# Altium schematic sheet 创意F1.SchDoc
size 762 x 401 mm
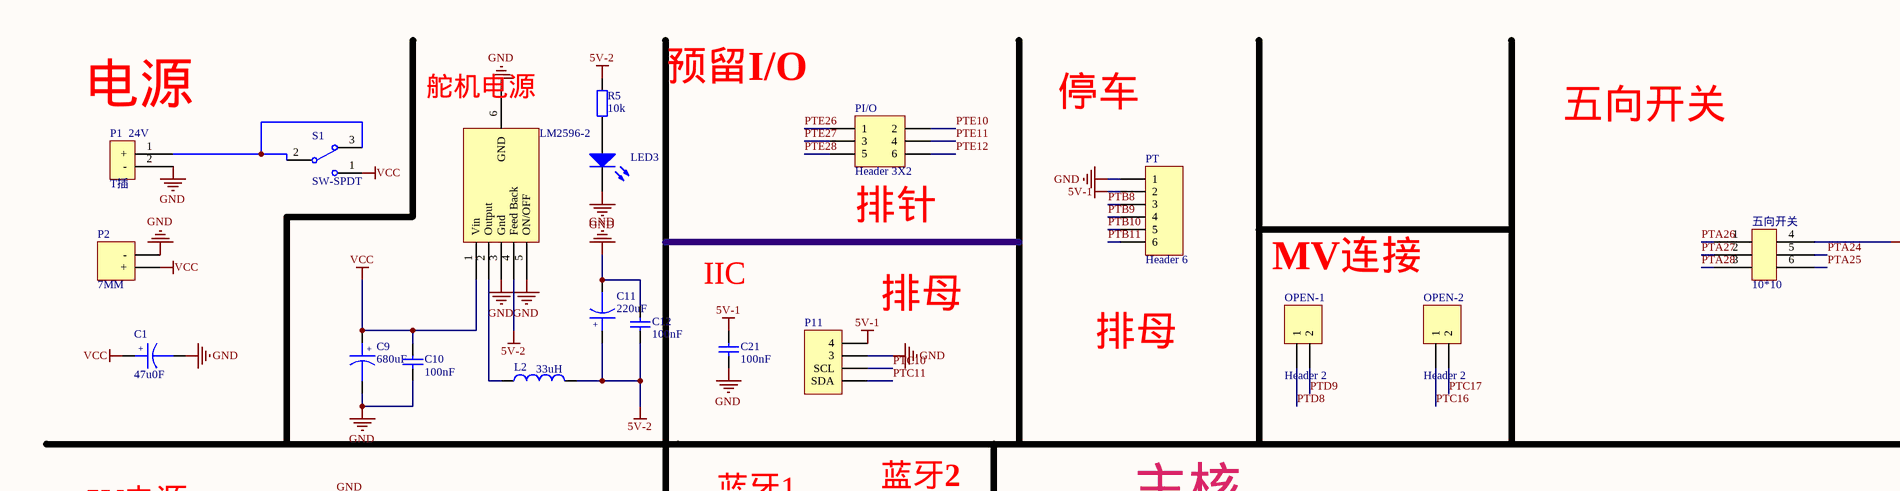
[diagram p0: 创意F1.SchDoc, top left]
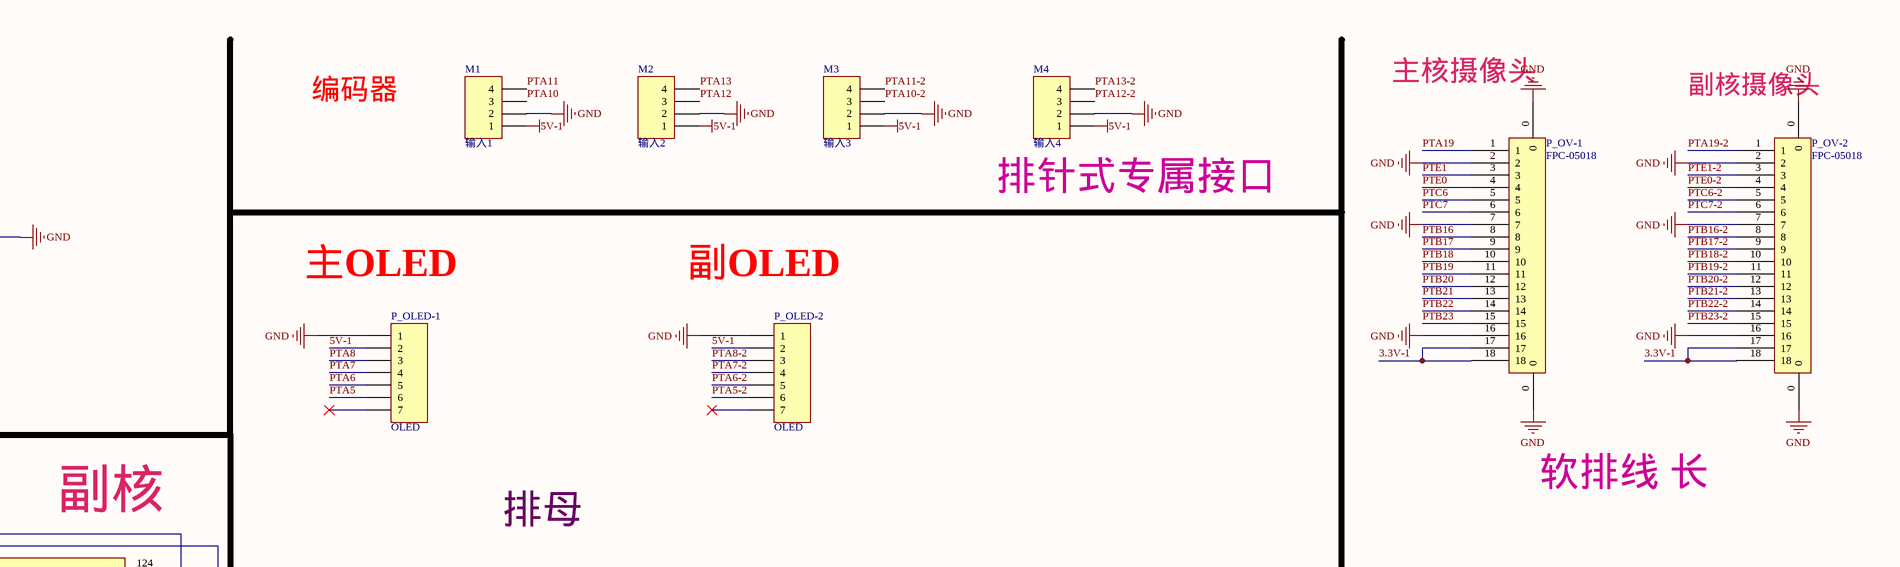
[diagram p1: 创意F1.SchDoc, top right]
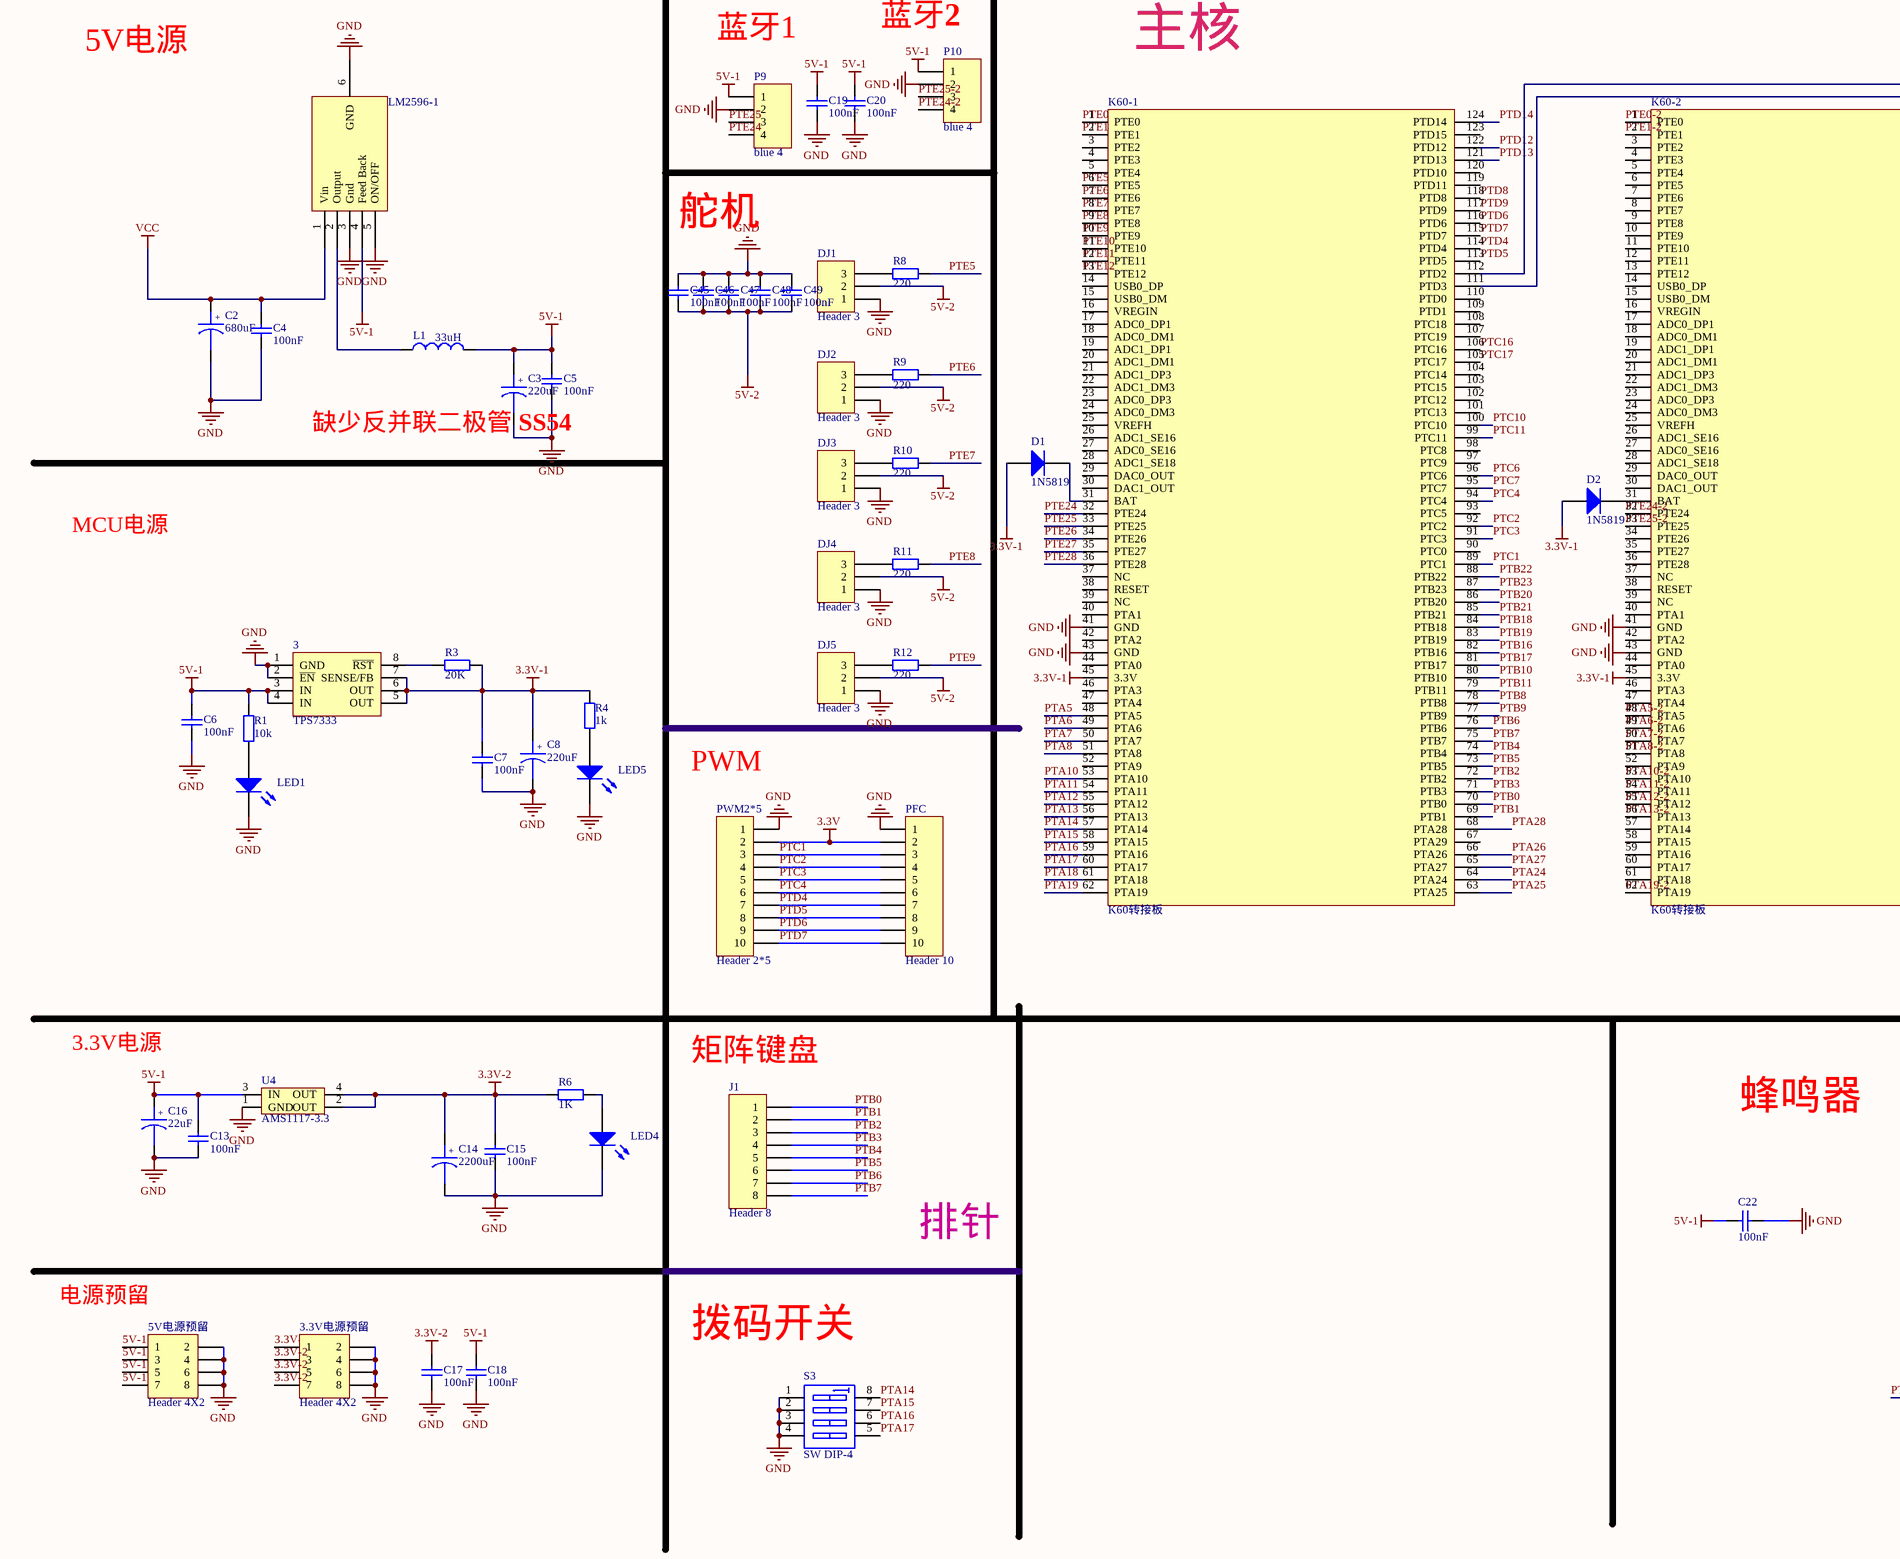
[diagram p2: 创意F1.SchDoc, bottom left]
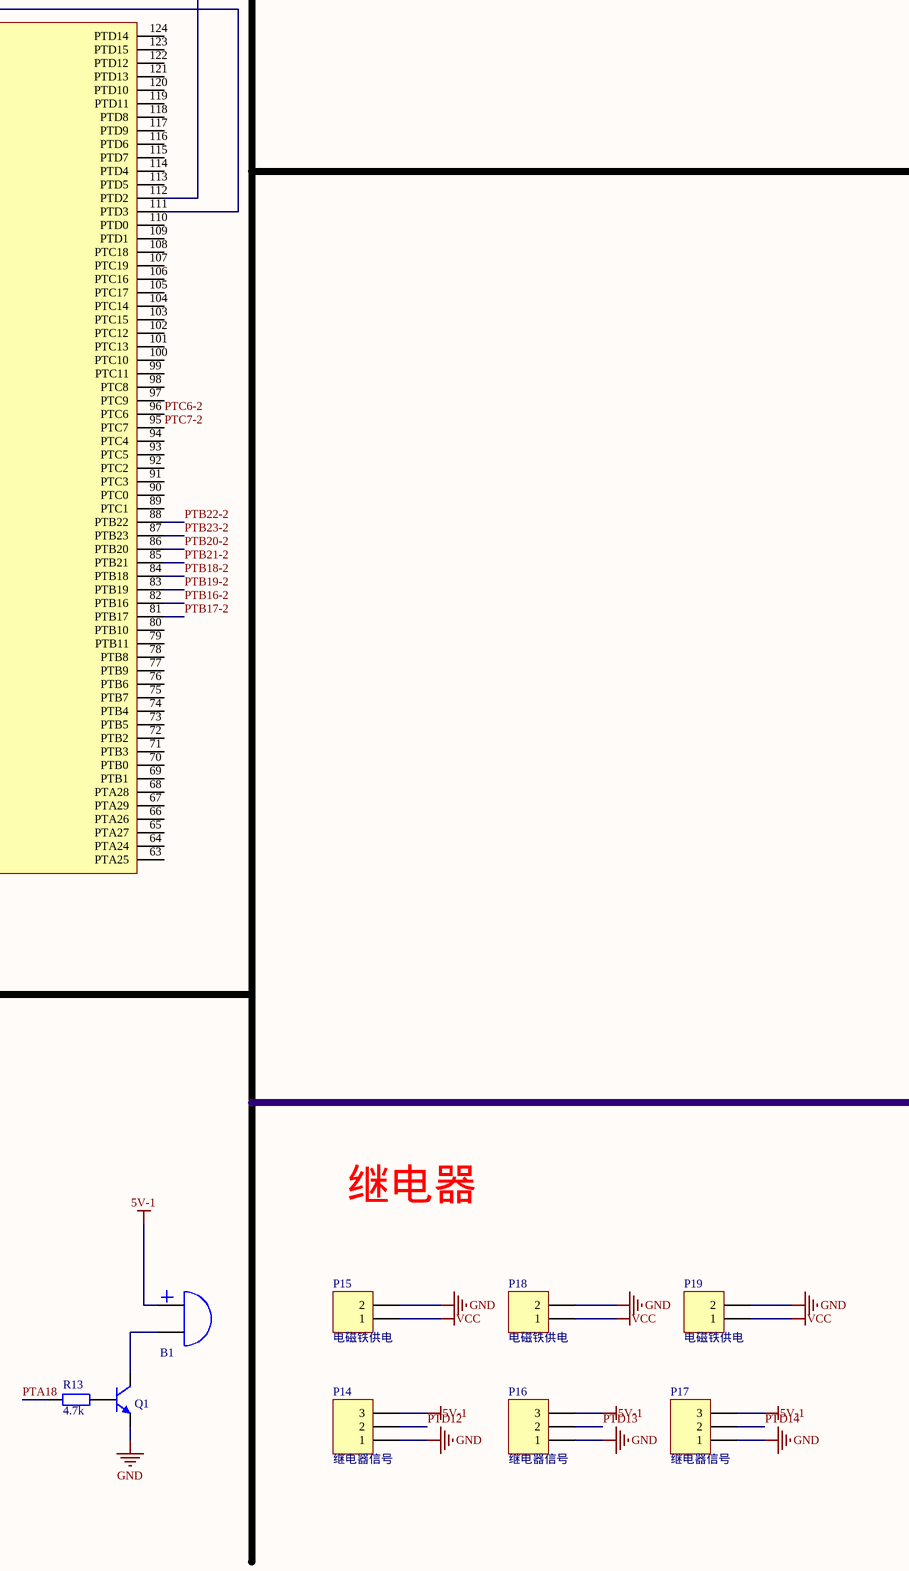
[diagram p3: 创意F1.SchDoc, bottom right]

## Parts
3  TPS7333  [SOP8]
3.3V电源预留  Header 4X2  [header2*4]
5V电源预留  Header 4X2  [header2*4]
B1  Bell  [蜂鸣器]  (value not drawn)
C1  47u0F  [RB-2]
C2  680uF  [RB-2]
C3  220uF  [贴片电容]
C4  100nF  [0805]
C5  100nF  [0805]
C6  100nF  [0805]
C7  100nF  [0805]
C8  220uF  [SMC]
C9  680uF  [RB-2]
C10  100nF  [0805]
C11  220uF  [贴片电容]
C12  100nF  [0805]
C13  100nF  [0805]
C14  2200uF  [贴片电容]
C15  100nF  [0805]
C16  22uF  [贴片电容]
C17  100nF  [0805]
C18  100nF  [0805]
C19  100nF  [0805]
C20  100nF  [0805]
C21  100nF  [0805]
C22  100nF  [0805]
C45  100nF  [0805]
C46  100nF  [0805]
C47  100nF  [0805]
C48  100nF  [0805]
C49  100nF  [0805]
D1  1N5819  [SMB]
D2  1N5819  [SMB]
DJ1  Header 3  [HDR1X3_]
DJ2  Header 3  [HDR1X3_]
DJ3  Header 3  [HDR1X3_]
DJ4  Header 3  [HDR1X3_]
DJ5  Header 3  [HDR1X3_]
J1  Header 8  [HDR1X8_]
K60-1  K60转接板  [K60核心板]
K60-2  K60转接板  [K60核心板]
L1  33uH  [RB-4]
L2  33uH  [RB-4]
LED1  (no value)  [0805]
LED3  (no value)  [0805]
LED4  (no value)  [0805]
LED5  (no value)  [0805]
LM2596-1  Component_1  [TO-263-5]  (value not drawn)
LM2596-2  Component_1  [TO-263-5]  (value not drawn)
M1  输入1  [HDR1X4_]
M2  输入2  [HDR1X4_]
M3  输入3  [HDR1X4_]
M4  输入4  [HDR1X4_]
OPEN-1  Header 2  [HDR1X2_]
OPEN-2  Header 2  [HDR1X2_]
P1_24V  T插  [T型端子]
P2  7MM  [5MM端子]
P9  blue 4  [HDR1X4_]
P10  blue 4  [HDR1X4_]
P11  Header 4  [HDR1X4_]  (value not drawn)
P14  继电器信号  [HDR1X3_]
P15  电磁铁供电  [5MM端子]
P16  继电器信号  [HDR1X3_]
P17  继电器信号  [HDR1X3_]
P18  电磁铁供电  [5MM端子]
P19  电磁铁供电  [5MM端子]
P_OLED-1  OLED  [HDR1X7_]
P_OLED-2  OLED  [HDR1X7_]
P_OV-1  FPC-05018  [FPC-05018]
P_OV-2  FPC-05018  [FPC-05018]
PFC  Header 10  [FPC1.0-2H-WS-10P]
PI/O  Header 3X2  [header2*4]
PT  Header 6  [HDR1X6_]
PWM2*5  Header 2*5  [header2*5]
Q1  s9014  [贴片三极管]  (value not drawn)
R1  10k  [0805]
R3  20K  [0805]
R4  1k  [0805]
R5  10k  [0805]
R6  1K  [0805]
R8  220  [0805]
R9  220  [0805]
R10  220  [0805]
R11  220  [0805]
R12  220  [0805]
R13  4.7k  [0805]
S1  SW-SPDT  [钮子开关]
S3  SW DIP-4  [DIP8_x]
U4  AMS1117-3.3  [SOT-223]
五向开关  10*10  [五向开关10*10]

## Nets
3.3V: PFC.2 PWM2*5.2
3.3V-1: 3.5(OUT) 3.6(OUT) 3.7(SENSE/FB) C7.2 C8.1 D1.1(A) D2.1(A) K60-1.45(3.3V) K60-2.45(3.3V) P_OV-1.17 P_OV-1.18 P_OV-2.17 P_OV-2.18 R3.2 R4.2
3.3V-2: 3.3V电源预留.1 3.3V电源预留.3 3.3V电源预留.5 3.3V电源预留.7 C14.1 C15.2 C17.2 R6.1 U4.2(OUT) U4.4(OUT)
5V-1: 3.3(IN) 3.4(IN) 5V电源预留.1 5V电源预留.3 5V电源预留.5 5V电源预留.7 B1.1(A) C3.1 C5.2 C6.2 C13.2 C16.1 C18.2 C19.2 C20.2 C21.2 C22.2 L1.2 LM2596-1.4(Feed_Back) M1.1 M2.1 M3.1 M4.1 P9.1 P10.1 P11.4 P14.3 P16.3 P17.3 P_OLED-1.2 P_OLED-2.2 PT.2 R1.2 U4.3(IN)
5V-2: C11.1 C12.1 C45.2 C46.2 C47.2 C48.2 C49.2 DJ1.2 DJ2.2 DJ3.2 DJ4.2 DJ5.2 L2.2 LM2596-2.4(Feed_Back) R5.2
GND: 3.1(GND) 3.2(~{EN}) 3.3V电源预留.2 3.3V电源预留.4 3.3V电源预留.6 3.3V电源预留.8 5V电源预留.2 5V电源预留.4 5V电源预留.6 5V电源预留.8 C1.2 C2.2 C3.2 C4.1 C5.1 C6.1 C7.1 C8.2 C9.2 C10.1 C11.2 C12.2 C13.1 C14.2 C15.1 C16.2 C17.1 C18.1 C19.1 C20.1 C21.1 C22.1 C45.1 C46.1 C47.1 C48.1 C49.1 DJ1.1 DJ2.1 DJ3.1 DJ4.1 DJ5.1 K60-1.41(GND) K60-1.43(GND) K60-2.41(GND) K60-2.43(GND) LED1.2(K) LED3.2(K) LED4.2(K) LED5.2(K) LM2596-1.3(Gnd) LM2596-1.5(ON/OFF) LM2596-1.6(GND) LM2596-2.3(Gnd) LM2596-2.5(ON/OFF) LM2596-2.6(GND) M1.2 M2.2 M3.2 M4.2 P1_24V.2(-) P2.2(-) P9.2 P10.2 P11.3 P14.1 P15.2 P16.1 P17.1 P18.2 P19.2 P_OLED-1.1 P_OLED-2.1 P_OV-1.0 P_OV-1.2 P_OV-1.7 P_OV-1.16 P_OV-2.0 P_OV-2.2 P_OV-2.7 P_OV-2.16 PFC.1 PT.1 PWM2*5.1 Q1.E S3.1(A1) S3.2(A2) S3.3(A3) S3.4(A4) U4.1(GND) 五向开关.4
VCC: C1.1 C2.1 C4.2 C9.1 C10.2 LM2596-1.1(Vin) LM2596-2.1(Vin) P2.1(+) P15.1 P18.1 P19.1 S1.1
PTA5: K60-1.48(PTA5) P_OLED-1.6
PTA5-2: K60-2.48(PTA5) P_OLED-2.6
PTA6: K60-1.49(PTA6) P_OLED-1.5
PTA6-2: K60-2.49(PTA6) P_OLED-2.5
PTA7: K60-1.50(PTA7) P_OLED-1.4
PTA7-2: K60-2.50(PTA7) P_OLED-2.4
PTA8: K60-1.51(PTA8) P_OLED-1.3
PTA8-2: K60-2.51(PTA8) P_OLED-2.3
PTA10: K60-1.53(PTA10) M1.3
PTA10-2: K60-2.53(PTA10) M3.3
PTA11: K60-1.54(PTA11) M1.4
PTA11-2: K60-2.54(PTA11) M3.4
PTA12: K60-1.55(PTA12) M2.3
PTA12-2: K60-2.55(PTA12) M4.3
PTA13: K60-1.56(PTA13) M2.4
PTA13-2: K60-2.56(PTA13) M4.4
PTA14: K60-1.57(PTA14) S3.8(B1)
PTA15: K60-1.58(PTA15) S3.7(B2)
PTA16: K60-1.59(PTA16) S3.6(B3)
PTA17: K60-1.60(PTA17) S3.5(B4)
PTA18: K60-1.61(PTA18) R13.1
PTA19: K60-1.62(PTA19) P_OV-1.1
PTA19-2: K60-2.62(PTA19) P_OV-2.1
PTA24: K60-1.64(PTA24) 五向开关.5
PTA25: K60-1.63(PTA25) 五向开关.6
PTA26: K60-1.66(PTA26) 五向开关.1
PTA27: K60-1.65(PTA27) 五向开关.2
PTA28: K60-1.68(PTA28) 五向开关.3
PTB0: J1.1 K60-1.70(PTB0)
PTB1: J1.2 K60-1.69(PTB1)
PTB2: J1.3 K60-1.72(PTB2)
PTB3: J1.4 K60-1.71(PTB3)
PTB4: J1.5 K60-1.74(PTB4)
PTB5: J1.6 K60-1.73(PTB5)
PTB6: J1.7 K60-1.76(PTB6)
PTB7: J1.8 K60-1.75(PTB7)
PTB8: K60-1.78(PTB8) PT.3
PTB9: K60-1.77(PTB9) PT.4
PTB10: K60-1.80(PTB10) PT.5
PTB11: K60-1.79(PTB11) PT.6
PTB16: K60-1.82(PTB16) P_OV-1.8
PTB16-2: K60-2.82(PTB16) P_OV-2.8
PTB17: K60-1.81(PTB17) P_OV-1.9
PTB17-2: K60-2.81(PTB17) P_OV-2.9
PTB18: K60-1.84(PTB18) P_OV-1.10
PTB18-2: K60-2.84(PTB18) P_OV-2.10
PTB19: K60-1.83(PTB19) P_OV-1.11
PTB19-2: K60-2.83(PTB19) P_OV-2.11
PTB20: K60-1.86(PTB20) P_OV-1.12
PTB20-2: K60-2.86(PTB20) P_OV-2.12
PTB21: K60-1.85(PTB21) P_OV-1.13
PTB21-2: K60-2.85(PTB21) P_OV-2.13
PTB22: K60-1.88(PTB22) P_OV-1.14
PTB22-2: K60-2.88(PTB22) P_OV-2.14
PTB23: K60-1.87(PTB23) P_OV-1.15
PTB23-2: K60-2.87(PTB23) P_OV-2.15
PTC1: K60-1.89(PTC1) PFC.3 PWM2*5.3
PTC2: K60-1.92(PTC2) PFC.4 PWM2*5.4
PTC3: K60-1.91(PTC3) PFC.5 PWM2*5.5
PTC4: K60-1.94(PTC4) PFC.6 PWM2*5.6
PTC6: K60-1.96(PTC6) P_OV-1.5
PTC6-2: K60-2.96(PTC6) P_OV-2.5
PTC7: K60-1.95(PTC7) P_OV-1.6
PTC7-2: K60-2.95(PTC7) P_OV-2.6
PTC10: K60-1.100(PTC10) P11.2(SCL)
PTC11: K60-1.99(PTC11) P11.1(SDA)
PTC16: K60-1.106(PTC16) OPEN-2.1
PTC17: K60-1.105(PTC17) OPEN-2.2
PTD4: K60-1.114(PTD4) PFC.7 PWM2*5.7
PTD5: K60-1.113(PTD5) PFC.8 PWM2*5.8
PTD6: K60-1.116(PTD6) PFC.9 PWM2*5.9
PTD7: K60-1.115(PTD7) PFC.10 PWM2*5.10
PTD8: K60-1.118(PTD8) OPEN-1.1
PTD9: K60-1.117(PTD9) OPEN-1.2
PTD12: K60-1.122(PTD12) P14.2
PTD13: K60-1.121(PTD13) P16.2
PTD14: K60-1.124(PTD14) P17.2
PTE0: K60-1.1(PTE0) P_OV-1.4
PTE0-2: K60-2.1(PTE0) P_OV-2.4
PTE1: K60-1.2(PTE1) P_OV-1.3
PTE1-2: K60-2.2(PTE1) P_OV-2.3
PTE5: K60-1.6(PTE5) R8.1
PTE6: K60-1.7(PTE6) R9.1
PTE7: K60-1.8(PTE7) R10.1
PTE8: K60-1.9(PTE8) R11.1
PTE9: K60-1.10(PTE9) R12.1
PTE10: K60-1.11(PTE10) PI/O.2
PTE11: K60-1.12(PTE11) PI/O.4
PTE12: K60-1.13(PTE12) PI/O.6
PTE24: K60-1.32(PTE24) P9.4
PTE24-2: K60-2.32(PTE24) P10.4
PTE25: K60-1.33(PTE25) P9.3
PTE25-2: K60-2.33(PTE25) P10.3
PTE26: K60-1.34(PTE26) PI/O.1
PTE27: K60-1.35(PTE27) PI/O.3
PTE28: K60-1.36(PTE28) PI/O.5
Net3_8: 3.8(~{RST}) R3.1
NetB1_2: B1.2(B) Q1.C
NetD1_2: D1.2(K) K60-1.31(BAT)
NetD2_2: D2.2(K) K60-2.31(BAT)
NetDJ1_3: DJ1.3 R8.2
NetDJ2_3: DJ2.3 R9.2
NetDJ3_3: DJ3.3 R10.2
NetDJ4_3: DJ4.3 R11.2
NetDJ5_3: DJ5.3 R12.2
NetK60-1_111: K60-1.111(PTD3) K60-2.111(PTD3)
NetK60-1_112: K60-1.112(PTD2) K60-2.112(PTD2)
NetL1_1: L1.1 LM2596-1.2(Output)
NetL2_1: L2.1 LM2596-2.2(Output)
NetLED1_1: LED1.1(A) R1.1
NetLED3_1: LED3.1(A) R5.1
NetLED4_1: LED4.1(A) R6.2
NetLED5_1: LED5.1(A) R4.1
NetP1_24V_1: P1_24V.1(+) S1.2 S1.3
NetQ1_B: Q1.B R13.2

Not connected (* = marked no-connect by the designer): K60-1 3(PTE2) 4(PTE3) 5(PTE4) 14(USB0_DP) 15(USB0_DM) 16(VREGIN) 17(ADC0_DP1) 18(ADC0_DM1) 19(ADC1_DP1) 20(ADC1_DM1) 21(ADC1_DP3) 22(ADC1_DM3) 23(ADC0_DP3) 24(ADC0_DM3) 25(VREFH) 26(ADC1_SE16) 27(ADC0_SE16) 28(ADC1_SE18) 29(DAC0_OUT) 30(DAC1_OUT) 37(NC) 38(RESET) 39(NC) 40(PTA1) 42(PTA2) 44(PTA0) 46(PTA3) 47(PTA4) 52(PTA9) 67(PTA29) 90(PTC0) 93(PTC5) 97(PTC9) 98(PTC8) 101(PTC13) 102(PTC12) 103(PTC15) 104(PTC14) 107(PTC19) 108(PTC18) 109(PTD1) 110(PTD0) 119(PTD11) 120(PTD10) 123(PTD15); K60-2 3(PTE2) 4(PTE3) 5(PTE4) 6(PTE5) 7(PTE6) 8(PTE7) 9(PTE8) 10(PTE9) 11(PTE10) 12(PTE11) 13(PTE12) 14(USB0_DP) 15(USB0_DM) 16(VREGIN) 17(ADC0_DP1) 18(ADC0_DM1) 19(ADC1_DP1) 20(ADC1_DM1) 21(ADC1_DP3) 22(ADC1_DM3) 23(ADC0_DP3) 24(ADC0_DM3) 25(VREFH) 26(ADC1_SE16) 27(ADC0_SE16) 28(ADC1_SE18) 29(DAC0_OUT) 30(DAC1_OUT) 34(PTE26) 35(PTE27) 36(PTE28) 37(NC) 38(RESET) 39(NC) 40(PTA1) 42(PTA2) 44(PTA0) 46(PTA3) 47(PTA4) 52(PTA9) 57(PTA14) 58(PTA15) 59(PTA16) 60(PTA17) 61(PTA18) 63(PTA25) 64(PTA24) 65(PTA27) 66(PTA26) 67(PTA29) 68(PTA28) 69(PTB1) 70(PTB0) 71(PTB3) 72(PTB2) 73(PTB5) 74(PTB4) 75(PTB7) 76(PTB6) 77(PTB9) 78(PTB8) 79(PTB11) 80(PTB10) 89(PTC1) 90(PTC0) 91(PTC3) 92(PTC2) 93(PTC5) 94(PTC4) 97(PTC9) 98(PTC8) 99(PTC11) 100(PTC10) 101(PTC13) 102(PTC12) 103(PTC15) 104(PTC14) 105(PTC17) 106(PTC16) 107(PTC19) 108(PTC18) 109(PTD1) 110(PTD0) 113(PTD5) 114(PTD4) 115(PTD7) 116(PTD6) 117(PTD9) 118(PTD8) 119(PTD11) 120(PTD10) 121(PTD13) 122(PTD12) 123(PTD15) 124(PTD14); P_OLED-1 7*; P_OLED-2 7*

## Notes on the sheet
- (near P1_24V) 电源
- (near LM2596-2) 舵机电源
- 预留I/O
- 停车
- 五向开关
- 编码器
- 主核摄像头
- (near P_OV-2) 副核摄像头
- (near M4) 排针式专属接口
- (near PI/O) 排针
- IIC
- (near P11) 排母
- MV连接
- 主OLED
- 副OLED
- 排母
- 5V电源
- 蓝牙1
- (near P10) 蓝牙2
- 主核
- 软排线 长
- 副核
- 舵机
- 缺少反并联二极管 SS54
- MCU电源
- PWM
- 3.3V电源
- (near J1) 矩阵键盘
- 蜂鸣器
- 排针
- 继电器
- 电源预留
- 拨码开关
- (in symbol Cap+tan) +
- (in symbol Cap+电解) +

## Library data of the parts
3.3V电源预留 5V电源预留 = Header 4X2: Header, 4-Pin, Dual row; LatestRevisionDate: 17-Jul-2002; LatestRevisionNote: Re-released for DXP Platform.; Publisher: Altium Limited
B1 = Buffer
C1-C3 C9 C11 = Cap+电解
C4-C7 C10 C12 C13 C15 C17-C22 C45-C49 = Cap: 0805
C8 C14 C16 = Cap+tan: 6032
D1 D2 = Diode 1N5819: High Conductance Fast Diode; LatestRevisionDate: 17-Jul-2002; LatestRevisionNote: Re-released for DXP Platform.; DatasheetDocument: 1997; PackageReference: DO-35; Publisher: Altium Limited; Code_JEDEC: DO-204-AH; ComponentLink1Description: Manufacturer Link; ComponentLink2Description: Datasheet; ComponentLink2URL: http://www.fairchildsemi.com/ds/1N%2F1N4148.pdf
DJ1-DJ5 P14 P16 P17 = Header 3: Header, 3-Pin; LatestRevisionDate: 17-Jul-2002; LatestRevisionNote: Re-released for DXP Platform.; Publisher: Altium Limited
J1 = Header 8: Header, 8-Pin; LatestRevisionDate: 17-Jul-2002; LatestRevisionNote: Re-released for DXP Platform.; Publisher: Altium Limited
L1 L2 = INDUCTOR
LED1 LED3-LED5 = LED2: Typical RED, GREEN, YELLOW, AMBER GaAs LED; Published: 8-Jun-2000; LatestRevisionDate: 17-Jul-2002; LatestRevisionNote: Re-released for DXP Platform.; PackageDocument: Feb-2002; PackageReference: 3.2X1.6X1.1; Publisher: Altium Limited
M1-M4 P11 = Header 4: Header, 4-Pin; LatestRevisionDate: 17-Jul-2002; LatestRevisionNote: Re-released for DXP Platform.; Publisher: Altium Limited
OPEN-1 OPEN-2 P15 P18 P19 = Header 2: Header, 2-Pin; LatestRevisionDate: 17-Jul-2002; LatestRevisionNote: Re-released for DXP Platform.; Publisher: Altium Limited
P1_24V = T插-公
P2 = 接线端子: 端子; LatestRevisionDate: 17-Jul-2002; LatestRevisionNote: Re-released for DXP Platform.; Publisher: Altium Limited
P9 P10 = blue 4: blue, 4-Pin; LatestRevisionDate: 17-Jul-2002; LatestRevisionNote: Re-released for DXP Platform.; Publisher: Altium Limited
P_OLED-1 P_OLED-2 = Header 7: Header, 7-Pin; LatestRevisionDate: 17-Jul-2002; LatestRevisionNote: Re-released for DXP Platform.; Publisher: Altium Limited
PFC PWM2*5 = Header 10: Header, 10-Pin; LatestRevisionDate: 17-Jul-2002; LatestRevisionNote: Re-released for DXP Platform.; Publisher: Altium Limited
PI/O = Header 3X2: Header, 3-Pin, Dual row; LatestRevisionDate: 17-Jul-2002; LatestRevisionNote: Re-released for DXP Platform.; Publisher: Altium Limited
PT = Header 6: Header, 6-Pin; LatestRevisionDate: 17-Jul-2002; LatestRevisionNote: Re-released for DXP Platform.; Publisher: Altium Limited
Q1 = s9014 贴片
R1 R4 R5 = Res2: Resistor; Published: 8-Jun-2000; LatestRevisionDate: 17-Jul-2002; LatestRevisionNote: Re-released for DXP Platform.; PackageReference: AXIAL-0.4; Publisher: Altium Limited; PackageDescription: Axial Device, Thru-Hole; 2 Leads; 0.4 in Pin Spacing
R3 R6 R8-R12 = Res: 0805
R13 = Res C0805: resistor; Value: 4.7k
S1 = SW-SPDT: SPDT Subminiature Toggle Switch, Right Angle Mounting, Vertical Actuation; Published: 24-Mar-1999; LatestRevisionDate: 17-Dec-2003; LatestRevisionNote: Schematic revised, PCB Footprint replaced.; DatasheetDocument: 05-Dec-2000; PackageReference: TL36WW15050; Publisher: Altium Limited; ComponentLink1Description: Manufacturer Link; ComponentLink1URL: http://www.apem.com
S3 = SW DIP-4: DIP Switch, 4 Position, SPST; Published: 24-Mar-1999; LatestRevisionDate: 29-May-2009; LatestRevisionNote: IPC-7351 Footprint Added.; PackageVersion: Dec-2002; PackageReference: SO8; Publisher: Altium Limited; PackageDescription: 8-Pin Small Outline Integrated Circuit 1.27 mm Pitch; Code_JEDEC: MS-012-AA; Code_IPC: SOIC127P600-8
U4 = AMS1117
五向开关 = Component_1